# Altium project Cooling_Protection_PDB.PrjPcb
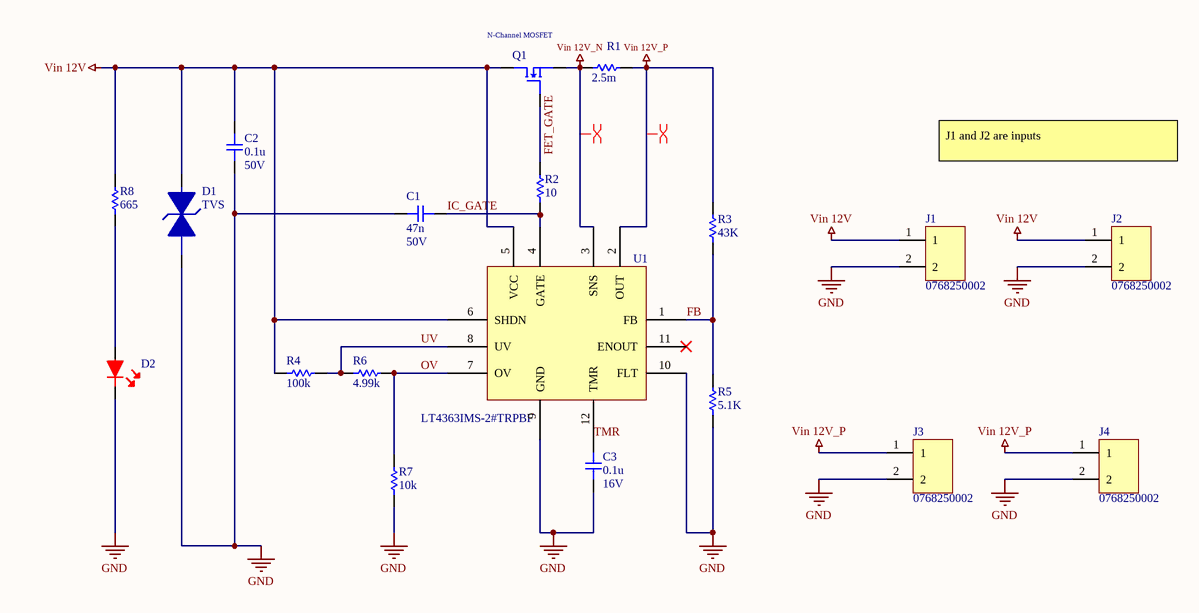
[diagram p0: Main Schematic.SchDoc]
1 sheet, 19 parts. Net scope: global (net labels, ports and power ports of the same name join across sheets).
Board file: Cooling_Protection PCB.PcbDoc

## Sheet Main Schematic.SchDoc
size A4; SheetNumber: 1; SheetTotal: 1

### Parts
C1  47n  Voltage Rating (DC): 50V  [C0603]
C2  0.1u  Voltage Rating: 50V  [C0805]
C3  0.1u  Voltage Rating: 16V  [C0603]
D1  TVS  [TVS]
D2  R-LED  [D-0603]  (value not drawn)
J1  0768250002  [2X1PIN]
J2  0768250002  [2X1PIN]
J3  0768250002  [2X1PIN]
J4  0768250002  [2X1PIN]
Q1  N-Channel MOSFET  [N-MOS]
R1  2.5m  [R3921]
R2  10  [R0603]
R3  43K  [R0603]
R4  100k  [R0603]
R5  5.1K  [R0603]
R6  4.99k  [R0603]
R7  10k  [R0603]
R8  665  [R0603]
U1  LT4363IMS-2#TRPBF  [TSOP65P490X110-12N]

### Nets
GND: C1.1 C2.1 C3.1 D1.2 D2.2 J1.2 J2.2 J3.2 J4.2 R5.1 R7.1 U1.9(GND) U1.10(FLT)
Vin 12V: C2.2 D1.1 J1.1 J2.1 Q1.2 R4.1 R8.2 U1.5(VCC) U1.6(SHDN)
Vin 12V_N: Q1.3 R1.1 U1.3(SNS)
Vin 12V_P: J3.1 J4.1 R1.2 R3.2 U1.2(OUT)
FB: R3.1 R5.2 U1.1(FB)
IC_GATE: C1.2 R2.1 U1.4(GATE)
OV: R6.2 R7.2 U1.7(OV)
TMR: C3.2 U1.12(TMR)
UV: R4.2 R6.1 U1.8(UV)
NetD2_1: D2.1 R8.1
NetQ1_1: Q1.1 R2.2

Not connected (* = marked no-connect by the designer): U1 11(ENOUT)*

### Layout directives
differential pair: Vin 12V_N, Vin 12V_P

### Notes on the sheet
- J1 and J2 are inputs
- Labels drawn without touching a wire or pin: FET_GATE

### Library data of the parts
C1 = C0603C473K5RACTU: C0603C 47nF Ceramic Multilayer Capacitor; 50 VDC; +125degC; X7R Dielec; +/-10%; Manufacturer: KEMET; Tolerance: 10%; Dissipation Factor: 2.5%; Supplier 1: Digi-Key; Manufacturer Part Number: C0603C473K5RACTU; RoHS: Yes; Category: Ceramic Capacitors; Stock 1: 1799272; Pricing 1: 1=0.10000, 10=0.07100, 50=0.03860, 100=0.03160, 500=0.02254, 1000=0.01771 (USD); Mount: Surface Mount,PCB; Case/Package: 0603; Number of Pins: 2; Dielectric Material: Ceramic; Case Code (Metric): 1608; Case Code (Imperial): 0603; Min Operating Temperature: -55°C; Max Operating Temperature: 125°C; Capacitance: 47nF; Dielectric: X7R; Packaging: Tape and Reel; Package Quantity: 1; Voltage Rating: 50V; Termination: SMD/SMT; Series: C; Construction: Flat; Voltage: 50V; Length: 1.6mm; Width: 0.8mm; Height: 0.8mm; Lead Pitch: 0.7mm; Depth: 0.8mm; Thickness: 0.034inch; Radiation Hardening: No; RoHS Compliant: Yes; REACH SVHC: No SVHC; ComponentLink1URL: https://datasheet.ciiva.com/6074/1776093-6074329.pdf?src-supplier=Farnell; ComponentLink1Description: https://datasheet.ciiva.com/6074/1776093-6074329.pdf?src-supplier=Farnell; ComponentLink2URL: https://datasheet.ciiva.com/28682/1851736-28682298.pdf?src-supplier=Element14; ComponentLink2Description: https://datasheet.ciiva.com/28682/1851736-28682298.pdf?src-supplier=Element14; ComponentLink3URL: https://datasheet.ciiva.com/18193/getdatasheetpartid-94279-18193115.pdf?src-supplier=Verical; ComponentLink3Description: https://datasheet.ciiva.com/18193/getdatasheetpartid-94279-18193115.pdf?src-supplier=Verical; ComponentLink4URL: https://datasheet.ciiva.com/7823/1776093-7823803.pdf?src-supplier=Element14; ComponentLink4Description: https://datasheet.ciiva.com/7823/1776093-7823803.pdf?src-supplier=Element14; ComponentLink5URL: https://datasheet.ciiva.com/7823/1776093-7823804.pdf?src-supplier=Element14; ComponentLink5Description: https://datasheet.ciiva.com/7823/1776093-7823804.pdf?src-supplier=Element14; Supplier Part Number 1: 339-C0603C473K5RAC7867CT-ND
C2 = C0805C104Z5VACTU: Cap Ceramic 0.1uF 50V Y5V -20% to 80% SMD 0805 85°C Paper T/R; Manufacturer: KEMET; Capacitance: 100nF; Dissipation Factor: 5%; Supplier 1: Digi-Key; Manufacturer Part Number: C0805C104Z5VACTU; RoHS: Yes; Category: Ceramic Capacitors; Stock 1: 1385; Pricing 1: 1=0.10000, 10=0.05000, 50=0.02700, 100=0.02210, 500=0.01578, 1000=0.01240 (USD); Mount: Surface Mount,PCB; Case/Package: 0805; Number of Pins: 2; Case Code (Metric): 2012; Case Code (Imperial): 0805; Dielectric Material: Ceramic; Min Operating Temperature: -30°C; Max Operating Temperature: 85°C; Package Quantity: 1; Tolerance: 80%; Packaging: Tape and Reel; Voltage Rating (DC): 50V; Dielectric: Y5V; Termination: SMD/SMT; Voltage: 50V; Series: C0805C; Construction: Flat; Length: 2mm; Width: 0.049inch; Height: 0.9mm; Thickness: 0.039inch; Lead Pitch: 0.75mm; Depth: 1.25mm; Radiation Hardening: No; REACH SVHC: No SVHC; Lead Free: Lead Free; RoHS Compliant: Yes; ComponentLink1URL: https://datasheet.ciiva.com/7842/1470417-7842543.pdf?src-supplier=Element14; ComponentLink1Description: https://datasheet.ciiva.com/7842/1470417-7842543.pdf?src-supplier=Element14; ComponentLink2URL: https://datasheet.ciiva.com/18219/getdatasheetpartid-37101-18219255.pdf?src-supplier=Verical; ComponentLink2Description: https://datasheet.ciiva.com/18219/getdatasheetpartid-37101-18219255.pdf?src-supplier=Verical; ComponentLink3URL: https://datasheet.ciiva.com/26847/getdatasheetpartid-321176-26847799.pdf?src-supplier=Verical; ComponentLink3Description: https://datasheet.ciiva.com/26847/getdatasheetpartid-321176-26847799.pdf?src-supplier=Verical; ComponentLink4URL: https://datasheet.ciiva.com/14597/70095383-14597846.pdf?src-supplier=Allied+Electronics; ComponentLink4Description: https://datasheet.ciiva.com/14597/70095383-14597846.pdf?src-supplier=Allied+Electronics; ComponentLink5URL: https://datasheet.ciiva.com/14608/70095383-14608251.pdf?src-supplier=Allied+Electronics; ComponentLink5Description: https://datasheet.ciiva.com/14608/70095383-14608251.pdf?src-supplier=Allied+Electronics; Supplier Part Number 1: 399-C0805C104Z5VAC7800CT-ND
C3 = C0603C104M4RACTU: Cap Ceramic 0.1uF 16V X7R 20% SMD 0603 125°C Paper T/R; Manufacturer: KEMET; Capacitance: 100nF; Supplier 1: Digi-Key; Manufacturer Part Number: C0603C104M4RACTU; RoHS: Yes; Category: Ceramic Capacitors; Stock 1: 293652; Pricing 1: 1=0.10000, 10=0.03300, 50=0.01800, 100=0.01470, 500=0.01046, 1000=0.00822 (USD); Mount: Surface Mount,PCB; Case/Package: 0603; Number of Pins: 2; Case Code (Metric): 1608; Case Code (Imperial): 0603; Dielectric Material: Ceramic; Min Operating Temperature: -55°C; Max Operating Temperature: 125°C; Package Quantity: 1; Tolerance: 20%; Packaging: Tape and Reel; Voltage Rating (DC): 16V; Dielectric: X7R; Termination: SMD/SMT; Series: C; Construction: Flat; Length: 1.6mm; Width: 0.031inch; Height: 0.8mm; Thickness: 0.034inch; Lead Pitch: 0.7mm; Depth: 0.8mm; Radiation Hardening: No; REACH SVHC: No SVHC; RoHS Compliant: Yes; ComponentLink1URL: https://datasheet.ciiva.com/7823/kem-c1002-x7r-smd-7823992.pdf?src-supplier=Element14; ComponentLink1Description: https://datasheet.ciiva.com/7823/kem-c1002-x7r-smd-7823992.pdf?src-supplier=Element14; ComponentLink2URL: https://datasheet.ciiva.com/7823/kem-c1002-x7r-smd-7823993.pdf?src-supplier=Element14; ComponentLink2Description: https://datasheet.ciiva.com/7823/kem-c1002-x7r-smd-7823993.pdf?src-supplier=Element14; ComponentLink3URL: https://datasheet.ciiva.com/14589/70095383-14589450.pdf?src-supplier=Allied+Electronics; ComponentLink3Description: https://datasheet.ciiva.com/14589/70095383-14589450.pdf?src-supplier=Allied+Electronics; ComponentLink4URL: https://datasheet.ciiva.com/18102/getdatasheetpartid-66190-18102310.pdf?src-supplier=Verical; ComponentLink4Description: https://datasheet.ciiva.com/18102/getdatasheetpartid-66190-18102310.pdf?src-supplier=Verical; ComponentLink5URL: https://datasheet.ciiva.com/18192/getdatasheetpartid-302288-18192716.pdf?src-supplier=Verical; ComponentLink5Description: https://datasheet.ciiva.com/18192/getdatasheetpartid-302288-18192716.pdf?src-supplier=Verical; Supplier Part Number 1: 339-C0603C104M4RAC7867CT-ND
D1 = SMAJ58A-13-F: SMAJ Series 58 V 400 W SMT Uni-Directional TVS Diode - DO-214AC; Manufacturer: Diodes; Direction: Unidirectional; Reverse Breakdown Voltage: 64.4V; Number of Elements: 1; Reverse Standoff Voltage: 58V; Clamping Voltage: 93.6V; Peak Pulse Power: 400W; Max Reverse Leakage Current: 5uA; Test Current: 1mA; Peak Pulse Current: 4.3A; Element Configuration: Single; Power Line Protection: No; Diode Type: ZENER; Max Breakdown Voltage: 71.2V; Current: 43A; Forward Voltage: 3.5V; Capacitance: 180pF; Supplier 1: RSComponents; Manufacturer Part Number: SMAJ58A-13-F; RoHS: Yes; Category: TVS Diodes; Stock 1: 1; Pricing 1: 50=0.37000, 250=0.16700, 1250=0.12900, 2500=0.12200, 5000=0.11100 (USD); Mount: Surface Mount; Case/Package: SMA; Number of Pins: 2; Contact Plating: Tin,Matte; Min Operating Temperature: -55°C; Max Operating Temperature: 150°C; Package Quantity: 5000; Packaging: Tape and Reel; Min Breakdown Voltage: 64.4V; Polarity: Unidirectional; Breakdown Voltage: 64.4V; Leakage Current: 5uA; Termination: SMD/SMT; Series: -; Number of Unidirectional Channels: 1; Max Power Dissipation: 400W; Resistor Type: Zener; Voltage: 58V; Power Dissipation: 400W; Clamping Voltage-Max: 93.6V; ESD Protection: No; Working Voltage: 58V; Max Output Current: 4.3A; Length: 2.92mm; Width: 4.6mm; Height: 2.3mm; Radiation Hardening: No; RoHS Compliant: Yes; Lead Free: Lead Free; ComponentLink1URL: https://datasheet.ciiva.com/334/ds19005-334624.pdf?src-supplier=Digi-Key; ComponentLink1Description: https://datasheet.ciiva.com/334/ds19005-334624.pdf?src-supplier=Digi-Key; ComponentLink2URL: https://datasheet.ciiva.com/34302/1542135-34302430.pdf?src-supplier=Jameco; ComponentLink2Description: https://datasheet.ciiva.com/34302/1542135-34302430.pdf?src-supplier=Jameco; Supplier Part Number 1: 7515010
D2 = 150060RS75000: LED Low-Power Uni-Color Red 630nm 2V 2-Pin Chip 0603(1608Metric) T/R; Manufacturer: Wurth Electronics; Viewing Angle: 140°; Lens Style: Clear,Rectangular; Luminous Intensity: 250mcd; Forward Current: 30mA; Wavelength: 625nm; Test Current: 20mA; Supplier 1: Digi-Key; Manufacturer Part Number: 150060RS75000; RoHS: Yes; Category: LEDs; Stock 1: 42280; Pricing 1: 1=0.15000, 50=0.13800, 100=0.11800, 500=0.10200, 1000=0.09900 (USD); Mount: Surface Mount; Case/Package: 0603; Color: Red; Case Code (Metric): 1608; Case Code (Imperial): 0603; Min Operating Temperature: -40°C; Max Operating Temperature: 85°C; Package Quantity: 1; Packaging: Cut Tape; Forward Voltage: 2V; Dominant Wavelength: 625nm; Length: 1.6mm; Width: 0.8mm; Height: 0.7mm; REACH SVHC: Unknown; RoHS Compliant: Yes; ComponentLink1URL: https://datasheet.ciiva.com/29563/150060rs75000-29563040.pdf?src-supplier=Digi-Key; ComponentLink1Description: https://datasheet.ciiva.com/29563/150060rs75000-29563040.pdf?src-supplier=Digi-Key; ComponentLink2URL: https://datasheet.ciiva.com/29279/759428-da-01-en-chipled-0603-w-kl-rot-150060rs75000-29279196.pdf?src-supplier=Conrad; ComponentLink2Description: https://datasheet.ciiva.com/29279/759428-da-01-en-chipled-0603-w-kl-rot-150060rs75000-29279196.pdf?src-supplier=Conrad; Supplier Part Number 1: 732-4978-1-ND
J1-J4 = 2X1PIN: CONN HEADER R/A 2POS; Manufacturer: Molex; Manufacturer Part Number: 76825-0002; Number of Circuits: 2; Gender: Male; Pitch: 5.7mm; Supplier 1: Digi-Key; Stock 1: 0; Pricing 1: 1=1.13, 10=0.993, 25=0.9344, 50=0.8956, 100=0.8567, 250=0.7788, 500=0.70092, 1000=0.62304, 2500=0.56463 (USD); Color: Black; Contact Plating: Tin; Contact Material: Copper; Termination: Through Hole; Number of Rows: 2; Orientation: Right Angle; Number of Contacts: 2; REACH SVHC: Unknown; ComponentLink1URL: http://www.farnell.com/datasheets/1968956.pdf?src-supplier=Element14; ComponentLink1Description: http://www.farnell.com/datasheets/1968956.pdf?src-supplier=Element14; ComponentLink2URL: http://www.farnell.com/datasheets/2216551.pdf?src-supplier=Newark; ComponentLink2Description: http://www.farnell.com/datasheets/2216551.pdf?src-supplier=Newark; ComponentLink3URL: http://www.farnell.com/datasheets/2216551.pdf?src-supplier=Farnell; ComponentLink3Description: http://www.farnell.com/datasheets/2216551.pdf?src-supplier=Farnell; ComponentLink4URL: https://www.molex.com/pdm_docs/sd/768250002_sd.pdf?src-supplier=Digi-Key; ComponentLink4Description: https://www.molex.com/pdm_docs/sd/768250002_sd.pdf?src-supplier=Digi-Key; ComponentLink5URL: http://www.farnell.com/datasheets/2001779.pdf?src-supplier=Element14; ComponentLink5Description: http://www.farnell.com/datasheets/2001779.pdf?src-supplier=Element14; ComponentLink6URL: http://www.alliedelec.com/images/products/datasheets/bm/BrandonData/70717238.pdf?src-supplier=Allied+Electronics; ComponentLink6Description: http://www.alliedelec.com/images/products/datasheets/bm/BrandonData/70717238.pdf?src-supplier=Allied+Electronics; Supplier Part Number 1: WM11969-ND
Q1 = FDB33N25TM: N-Channel Power MOSFET, UniFETTM, 250 V, 33 A, 94 mΩ, D2PAK; Manufacturer: ON Semiconductor / Fairchild; Rise Time: 230ns; Continuous Drain Current (ID): 33A; Fall Time: 120ns; Turn-Off Delay Time: 75ns; Turn-On Delay Time: 35ns; Gate to Source Voltage (Vgs): 30V; Rds On Max: 94mR; Input Capacitance: 2.135nF; Max Power Dissipation: 235W; Number of Elements: 1; Nominal Vgs: 3V; Drain to Source Voltage (Vdss): 250V; Element Configuration: Single; Supplier 1: RSComponents; Manufacturer Part Number: FDB33N25TM; RoHS: Yes; Category: MOSFETs; Stock 1: 86; Pricing 1: 2=2.32700, 10=1.98700, 100=1.54200, 250=1.50000, 500=1.29900, 2=1.67500, 10=1.43000, 100=1.11000, 250=1.08000, 500=0.93500 (USD); Mount: Surface Mount; Case/Package: D2PAK; Number of Pins: 3; Contact Plating: Tin,Matte; Weight: 1.31247g; Min Operating Temperature: -55°C; Max Operating Temperature: 150°C; Packaging: Tape and Reel; Package Quantity: 800; Drain to Source Breakdown Voltage: 250V; Power Dissipation: 235W; Drain to Source Resistance: 94mR; Threshold Voltage: 3V; On-State Resistance: 94MR; Polarity: N-CHANNEL; Series: UniFET™; Drain-source On Resistance-Max: 94MR; Length: 10.67mm; Width: 11.33mm; Height: 4.83mm; Radiation Hardening: No; REACH SVHC: No SVHC; Lead Free: Lead Free; ComponentLink1URL: https://datasheet.ciiva.com/22655/1781196-22655255.pdf?src-supplier=Element14; ComponentLink1Description: https://datasheet.ciiva.com/22655/1781196-22655255.pdf?src-supplier=Element14; ComponentLink2URL: https://datasheet.ciiva.com/25625/0900766b810c95c5-25625337.pdf?src-supplier=RSComponents; ComponentLink2Description: https://datasheet.ciiva.com/25625/0900766b810c95c5-25625337.pdf?src-supplier=RSComponents; ComponentLink3URL: https://datasheet.ciiva.com/26145/fdb33n25-26145111.pdf?src-supplier=Avnet+Europe; ComponentLink3Description: https://datasheet.ciiva.com/26145/fdb33n25-26145111.pdf?src-supplier=Avnet+Europe; ComponentLink4URL: https://datasheet.ciiva.com/933/fdb33n25-933830.pdf?src-supplier=Digi-Key; ComponentLink4Description: https://datasheet.ciiva.com/933/fdb33n25-933830.pdf?src-supplier=Digi-Key; ComponentLink5URL: https://datasheet.ciiva.com/933/fdb33n25-933831.pdf?src-supplier=Digi-Key; ComponentLink5Description: https://datasheet.ciiva.com/933/fdb33n25-933831.pdf?src-supplier=Digi-Key; Supplier Part Number 1: 7598973
R1 = WSLP39212L500FEA: Res Metal Strip 3921 0.0025 Ohm 1% 5W 50ppm/°C Pad SMD Automotive T/R; Manufacturer: Vishay Dale; Resistance: 2.5mR; Max Power Dissipation: 9W; Temperature Coefficient: 75ppm/°C; Supplier 1: Digi-Key; Manufacturer Part Number: WSLP39212L500FEA; RoHS: Yes; Category: Chip SMD Resistors; Stock 1: 2532; Pricing 1: 1=1.99000, 10=1.76100, 25=1.63320, 50=1.53720, 100=1.34500, 250=1.15288, 500=0.96076, 1000=0.85400 (USD); Case/Package: 3921; Min Operating Temperature: -65°C; Max Operating Temperature: 170°C; Package Quantity: 3000; Packaging: Tape and Reel; Resistor Type: Metal Element; Number of Terminations: 2; Tolerance: 1%; Features: Moisture Resistant; Length: 0.394inch; Width: 0.205inch; Height: 0.02inch; RoHS Compliant: Yes; ComponentLink1URL: http://www.vishay.com/docs/30176/wslp3921.pdf?src-supplier=Digi-Key; ComponentLink1Description: http://www.vishay.com/docs/30176/wslp3921.pdf?src-supplier=Digi-Key; Supplier Part Number 1: 541-WSLP39212L500FEACT-ND
R2 = KTR03EZPF10R0: KTR Series 0603 10 Ohm ±1 % 0.1 W ±100 ppm/°C Surface Mount Thick Film Resistor; Manufacturer: Rohm; Resistance: 10R; Tolerance: 1%; Max Power Dissipation: 100mW; Supplier 1: Digi-Key; Manufacturer Part Number: KTR03EZPF10R0; RoHS: Yes; Category: Chip SMD Resistors; Stock 1: 25; Pricing 1: 1=0.15000, 10=0.13500, 100=0.05180, 1000=0.02277, 2500=0.01966 (USD); Case/Package: 0603; Case Code (Metric): 1608; Case Code (Imperial): 0603; Min Operating Temperature: -55°C; Max Operating Temperature: 155°C; Package Quantity: 1; Packaging: Tape and Reel; Resistor Type: Thick Film; Number of Terminations: 2; Temperature Coefficient: 100ppm/°C; Features: Automotive AEC-Q200; Series: KTR; Length: 0.063inch; Width: 0.031inch; Height: 0.022inch; Lead Free: Lead Free; RoHS Compliant: Yes; ComponentLink1URL: https://datasheet.ciiva.com/2498/ktr-2498917.pdf?src-supplier=Digi-Key; ComponentLink1Description: https://datasheet.ciiva.com/2498/ktr-2498917.pdf?src-supplier=Digi-Key; ComponentLink2URL: https://datasheet.ciiva.com/2498/ktr-2498918.pdf?src-supplier=Digi-Key; ComponentLink2Description: https://datasheet.ciiva.com/2498/ktr-2498918.pdf?src-supplier=Digi-Key; ComponentLink3URL: https://datasheet.ciiva.com/2498/ktr-2498919.pdf?src-supplier=Digi-Key; ComponentLink3Description: https://datasheet.ciiva.com/2498/ktr-2498919.pdf?src-supplier=Digi-Key; Supplier Part Number 1: RHM10.0AYCT-ND
R3 = RNCF0603DTE43K0: RNCF Precision Thin Film Chip Resistor 0603 Size 43K Ohm 0.5% 0.166 W 25 ppm/°C 2-Pin SMD T/R; Manufacturer: Stackpole Electronics; Power Rating: 63mW; Resistance: 43kR; Supplier 1: Digi-Key; Manufacturer Part Number: RNCF0603DTE43K0; RoHS: Yes; Category: Chip SMD Resistors; Stock 1: 9867; Pricing 1: 1=0.13000, 10=0.11000, 100=0.04300, 1000=0.01800, 2500=0.01650 (USD); Mount: Surface Mount; Case/Package: 0603; Min Operating Temperature: -55°C; Max Operating Temperature: 155°C; Tolerance: 0.5%; Packaging: Tape and Reel; RoHS Compliant: Yes; ComponentLink1URL: https://www.seielect.com/catalog/sei-rncf.pdf?src-supplier=Digi-Key; ComponentLink1Description: https://www.seielect.com/catalog/sei-rncf.pdf?src-supplier=Digi-Key; Supplier Part Number 1: RNCF0603DTE43K0CT-ND
R4 = RE0603FRE07100KL: Res Thick Film 0603 100K Ohm 1% 1/10W ±50ppm/°C Molded SMD Paper T/R; Manufacturer: Yageo; Resistance: 100kR; Max Power Dissipation: 100mW; Supplier 1: Digi-Key; Manufacturer Part Number: RE0603FRE07100KL; RoHS: Yes; Category: Chip SMD Resistors; Stock 1: 8496; Pricing 1: 1=0.10000, 10=0.03600, 100=0.01450, 1000=0.00649, 2500=0.00563 (USD); Case/Package: 0603; Min Operating Temperature: -55°C; Max Operating Temperature: 155°C; Packaging: Tape and Reel; Resistor Type: Thick Film; Number of Terminations: 2; Tolerance: 1%; Temperature Coefficient: 50ppm/°C; Features: Moisture Resistant; Length: 0.063inch; Width: 0.032inch; Height: 0.022inch; RoHS Compliant: Yes; ComponentLink1URL: http://www.yageo.com/NewPortal/yageodocoutput?fileName=/pdf/R-Chip/PYu-RE_105_RoHS_L_6.pdf&src-supplier=Digi-Key; ComponentLink1Description: http://www.yageo.com/NewPortal/yageodocoutput?fileName=/pdf/R-Chip/PYu-RE_105_RoHS_L_6.pdf&src-supplier=Digi-Key; Supplier Part Number 1: 13-RE0603FRE07100KLCT-ND
R5 = ERJ-3EKF5101V: Res Thick Film 0603 5.1K Ohm 1% 1/10W ±100ppm/°C Molded SMD Punched Carrier T/R; Manufacturer: Panasonic; Resistance: 5.1kR; Power Rating: 100mW; Voltage Rating: 75V; Supplier 1: Digi-Key; Manufacturer Part Number: ERJ-3EKF5101V; RoHS: Yes; Category: Chip SMD Resistors; Stock 1: 35748; Pricing 1: 1=0.10000, 10=0.04200, 100=0.01700, 1000=0.00762, 2500=0.00661 (USD); Mount: Surface Mount; Case/Package: 0603; Contact Plating: Tin; Case Code (Imperial): 0603; Case Code (Metric): 1608; Weight: 7.1E-05oz; Size Code: 0603; Min Operating Temperature: -55°C; Max Operating Temperature: 155°C; Tolerance: 1%; Package Quantity: 1; Resistor Type: Thick Film; Termination: SMD/SMT; Temperature Coefficient: 100ppm/°C; Series: ERJ; Packaging: Tape and Reel; Number of Terminations: 2; Max Power Dissipation: 100mW; Voltage Rating (DC): 75V; Features: Automotive AEC-Q200; Resistance Tolerance: 1%; Construction: Rectangular; Length: 1.6mm; Width: 0.8mm; Height: 0.022inch; Depth: 0.8mm; Radiation Hardening: No; REACH SVHC: No SVHC; Military Standard: Not; Lead Free: Lead Free; RoHS Compliant: Yes; ComponentLink1URL: https://datasheet.ciiva.com/5860/426256-5860664.pdf?src-supplier=Farnell; ComponentLink1Description: https://datasheet.ciiva.com/5860/426256-5860664.pdf?src-supplier=Farnell; ComponentLink2URL: https://datasheet.ciiva.com/28547/1678782-28547194.pdf?src-supplier=Element14; ComponentLink2Description: https://datasheet.ciiva.com/28547/1678782-28547194.pdf?src-supplier=Element14; ComponentLink3URL: https://datasheet.ciiva.com/28686/1678782-28686921.pdf?src-supplier=Element14; ComponentLink3Description: https://datasheet.ciiva.com/28686/1678782-28686921.pdf?src-supplier=Element14; ComponentLink4URL: https://datasheet.ciiva.com/16785/70260748-16785996.pdf?src-supplier=Allied+Electronics; ComponentLink4Description: https://datasheet.ciiva.com/16785/70260748-16785996.pdf?src-supplier=Allied+Electronics; ComponentLink5URL: https://datasheet.ciiva.com/16440/aoa0000ce3-16440166.pdf?src-supplier=Future+Electronics; ComponentLink5Description: https://datasheet.ciiva.com/16440/aoa0000ce3-16440166.pdf?src-supplier=Future+Electronics; ComponentLink6URL: https://datasheet.ciiva.com/16523/aoa0000ce2-16523461.pdf?src-supplier=Avnet+Asia; ComponentLink6Description: https://datasheet.ciiva.com/16523/aoa0000ce2-16523461.pdf?src-supplier=Avnet+Asia; Supplier Part Number 1: P5.10KHCT-ND
R6 = RMCF0603FT4K99: Res Thick Film 0603 4.99K Ohm 1% 1/10W ±100ppm/°C Molded SMD SMD Paper T/R; Manufacturer: Stackpole Electronics; Resistance: 4.99kR; Power Rating: 100mW; Working Voltage: 75V; Supplier 1: Digi-Key; Manufacturer Part Number: RMCF0603FT4K99; RoHS: Yes; Category: Chip SMD Resistors; Stock 1: 1158; Pricing 1: 1=0.10000, 10=0.01700, 100=0.00680, 1000=0.00305, 2500=0.00264 (USD); Mount: Surface Mount; Case/Package: 0603; Case Code (Metric): 1608; Case Code (Imperial): 0603; Contact Plating: Tin,Matte; Min Operating Temperature: -55°C; Max Operating Temperature: 155°C; Packaging: Tape and Reel; Tolerance: 1%; Package Quantity: 1; Resistor Type: Thick Film; Number of Terminations: 2; Max Power Dissipation: 100mW; Temperature Coefficient: 100ppm/°C; Features: Automotive AEC-Q200; Series: RMCF; Construction: Rectangular; Technology: THICK FILM; Length: 1.55mm; Width: 0.031inch; Height: 0.022inch; Depth: 0.8mm; Radiation Hardening: No; Military Standard: Not; Lead Free: Lead Free; RoHS Compliant: Yes; ComponentLink1URL: https://datasheet.ciiva.com/15215/getdatasheetpartid-407528-15215989.pdf?src-supplier=Verical; ComponentLink1Description: https://datasheet.ciiva.com/15215/getdatasheetpartid-407528-15215989.pdf?src-supplier=Verical; Supplier Part Number 1: RMCF0603FT4K99CT-ND
R7 = RC1608F103CS: Res Thick Film 0603 10K Ohm 1% 1/10W ±100ppm/°C Molded SMD SMD T/R; Manufacturer: Samsung; Resistance: 10kR; Power Rating: 100mW; Supplier 1: Digi-Key; Manufacturer Part Number: RC1608F103CS; RoHS: Yes; Category: Chip SMD Resistors; Stock 1: 1193; Pricing 1: 1=0.10000, 10=0.07400, 100=0.02850, 1000=0.01254 (USD); Case/Package: 0603; Contact Plating: Tin; Case Code (Metric): 1608; Case Code (Imperial): 0603; Size Code: 0603; Min Operating Temperature: -55°C; Max Operating Temperature: 155°C; Tolerance: 1%; Resistor Type: Thick Film; Temperature Coefficient: 100ppm/°C; Packaging: Tape and Reel; Number of Terminations: 2; Max Power Dissipation: 100mW; Features: Moisture Resistant; Series: RC; Construction: Rectangular; Length: 0.063inch; Width: 0.031inch; Height: 0.022inch; Depth: 0.8mm; Radiation Hardening: No; Military Standard: Not; RoHS Compliant: Yes; ComponentLink1URL: https://datasheet.ciiva.com/16200/rc-series-16200170.pdf?src-supplier=Future+Electronics; ComponentLink1Description: https://datasheet.ciiva.com/16200/rc-series-16200170.pdf?src-supplier=Future+Electronics; Supplier Part Number 1: 1276-3485-1-ND
R8 = RC0603FR-07665RL: Res Thick Film 0603 665 Ohm 1% 1/10W ±100ppm/°C Molded SMD Paper T/R; Manufacturer: Yageo; Resistance: 665R; Power Rating: 100mW; Voltage Rating: 75V; Voltage Rating (DC): 50V; Supplier 1: Digi-Key; Manufacturer Part Number: RC0603FR-07665RL; RoHS: Yes; Category: Chip SMD Resistors; Stock 1: 146637; Pricing 1: 1=0.10000, 10=0.02400, 100=0.00970, 1000=0.00436, 2500=0.00378 (USD); Case/Package: 0603; Contact Plating: Tin,Matte; Case Code (Imperial): 0603; Case Code (Metric): 1608; Weight: 7.1E-05oz; Min Operating Temperature: -55°C; Max Operating Temperature: 155°C; Tolerance: 1%; Resistor Type: Thick Film; Temperature Coefficient: 100ppm/°C; Packaging: Tape and Reel; Package Quantity: 1; Termination: SMD/SMT; Number of Terminations: 2; Max Power Dissipation: 100mW; Features: Moisture Resistant; Series: RC; Construction: Rectangular; Length: 1.6mm; Width: 0.8mm; Height: 0.022inch; Depth: 0.8mm; Military Standard: Not; Lead Free: Lead Free; RoHS Compliant: Yes; ComponentLink1URL: https://datasheet.ciiva.com/8885/pyu-rc0603-51-rohs-l-4-8885031.pdf?src-supplier=Avnet; ComponentLink1Description: https://datasheet.ciiva.com/8885/pyu-rc0603-51-rohs-l-4-8885031.pdf?src-supplier=Avnet; ComponentLink2URL: https://datasheet.ciiva.com/2454/pyu-r-int-thick-7-2454390.pdf?src-supplier=Digi-Key; ComponentLink2Description: https://datasheet.ciiva.com/2454/pyu-r-int-thick-7-2454390.pdf?src-supplier=Digi-Key; ComponentLink3URL: https://datasheet.ciiva.com/2454/pyu-r-int-thick-7-2454391.pdf?src-supplier=Digi-Key; ComponentLink3Description: https://datasheet.ciiva.com/2454/pyu-r-int-thick-7-2454391.pdf?src-supplier=Digi-Key; ComponentLink4URL: https://datasheet.ciiva.com/2454/pyu-r-int-thick-7-2454392.pdf?src-supplier=Digi-Key; ComponentLink4Description: https://datasheet.ciiva.com/2454/pyu-r-int-thick-7-2454392.pdf?src-supplier=Digi-Key; ComponentLink5URL: https://datasheet.ciiva.com/28388/pyu-rc0603-51-rohs-l-4-28388745.pdf?src-supplier=Avnet+Europe; ComponentLink5Description: https://datasheet.ciiva.com/28388/pyu-rc0603-51-rohs-l-4-28388745.pdf?src-supplier=Avnet+Europe; Supplier Part Number 1: 311-665HRCT-ND
U1 = LT4363IMS-2#TRPBF: Ms-Hot Swap/High Voltage High Voltage Surge Stopper With Current Limit. Auto-Retry After Fault; Manufacturer: Analog Devices / Linear Technology; Working Voltage: 80V; Clamping Voltage: 27V; Number of Circuits: 1; Supplier 1: Digi-Key; Manufacturer Part Number: LT4363IMS-2#TRPBF; RoHS: Yes; Category: Voltage Supervisors; Pricing 1: 1=6.21000, 10=5.57500, 25=5.27080, 100=4.56810, 250=4.33380, 500=3.88872, 1000=3.64650 (USD); Case/Package: TSSOP; Number of Pins: 12; Package Quantity: 2500; Packaging: Tape and Reel; Lead Free: Lead Free; RoHS Compliant: Yes; ComponentLink1URL: https://datasheet.ciiva.com/329/40854-329672.pdf?src-supplier=Digi-Key; ComponentLink1Description: https://datasheet.ciiva.com/329/40854-329672.pdf?src-supplier=Digi-Key; Supplier Part Number 1: LT4363IMS-2#TRPBFDKR-ND